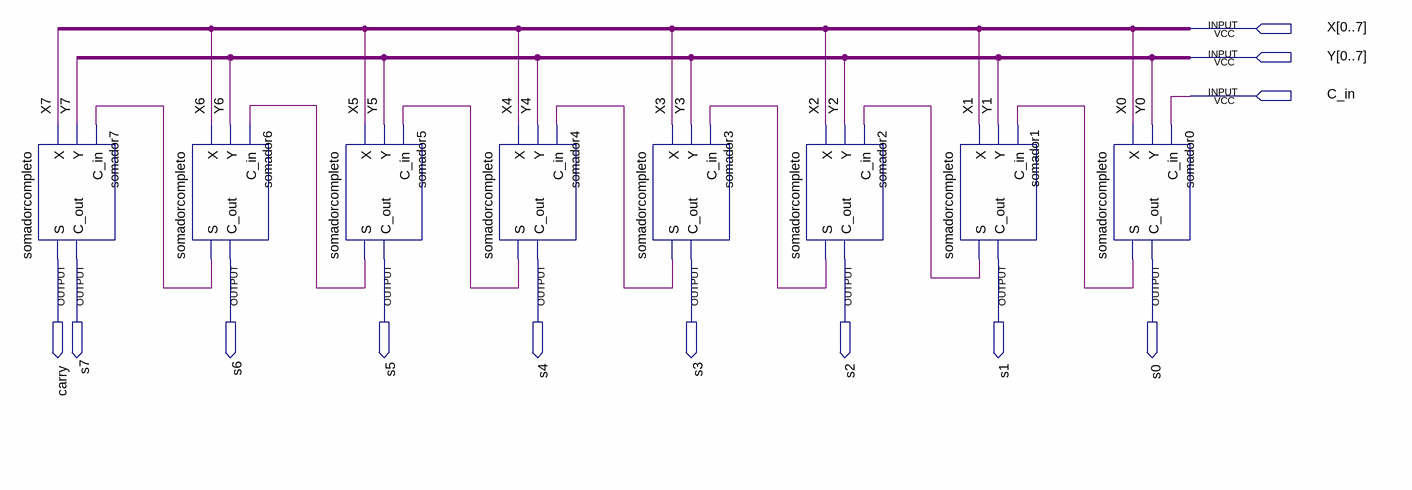
[diagram p0: schematic sheet]
// Quartus schematic ripplecarry8.bdf as structural Verilog: 8 symbols, 12 pins
module ripplecarry8 (
  input  [0:7] X,
  input  [0:7] Y,
  input  C_in,
  output carry,
  output s7,
  output s6,
  output s5,
  output s4,
  output s3,
  output s2,
  output s1,
  output s0
);

  wire somador0_s, somador1_s, somador2_s, somador3_s, somador4_s, somador5_s, somador6_s;

  somadorcompleto somador7 (.X(X[7]), .Y(Y[7]), .C_in(somador6_s), .S(carry), .C_out(s7));
  somadorcompleto somador6 (.X(X[6]), .Y(Y[6]), .C_in(somador5_s), .S(somador6_s), .C_out(s6));
  somadorcompleto somador5 (.X(X[5]), .Y(Y[5]), .C_in(somador4_s), .S(somador5_s), .C_out(s5));
  somadorcompleto somador4 (.X(X[4]), .Y(Y[4]), .C_in(somador3_s), .S(somador4_s), .C_out(s4));
  somadorcompleto somador3 (.X(X[3]), .Y(Y[3]), .C_in(somador2_s), .S(somador3_s), .C_out(s3));
  somadorcompleto somador2 (.X(X[2]), .Y(Y[2]), .C_in(somador1_s), .S(somador2_s), .C_out(s2));
  somadorcompleto somador1 (.X(X[1]), .Y(Y[1]), .C_in(somador0_s), .S(somador1_s), .C_out(s1));
  somadorcompleto somador0 (.X(X[0]), .Y(Y[0]), .C_in(C_in), .S(somador0_s), .C_out(s0));
endmodule
